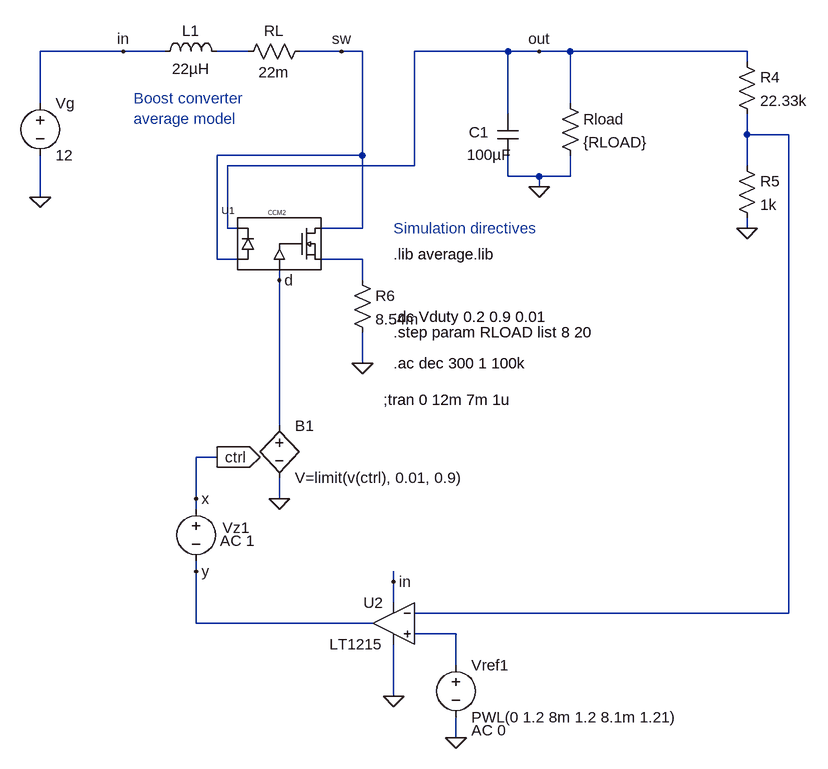
[diagram p0: schematic boost_average_CL_noCompensado.asc]
boost_average_CL_noCompensado.asc, the LTspice schematic file:
Version 4
SHEET 1 1848 724
WIRE 560 -352 432 -352
WIRE 624 -352 560 -352
WIRE 752 -352 704 -352
WIRE 896 -352 832 -352
WIRE 928 -352 896 -352
WIRE 1152 -352 1008 -352
WIRE 1200 -352 1152 -352
WIRE 1248 -352 1200 -352
WIRE 1520 -352 1248 -352
WIRE 1520 -336 1520 -352
WIRE 432 -272 432 -352
WIRE 1248 -272 1248 -352
WIRE 1152 -256 1152 -352
WIRE 1520 -224 1520 -256
WIRE 1584 -224 1520 -224
WIRE 928 -192 928 -352
WIRE 928 -192 704 -192
WIRE 1008 -176 1008 -352
WIRE 1008 -176 720 -176
WIRE 1520 -176 1520 -224
WIRE 1152 -160 1152 -192
WIRE 1200 -160 1152 -160
WIRE 1248 -160 1248 -192
WIRE 1248 -160 1200 -160
WIRE 1200 -144 1200 -160
WIRE 432 -128 432 -192
WIRE 720 -80 720 -176
WIRE 736 -80 720 -80
WIRE 928 -80 928 -192
WIRE 928 -80 864 -80
WIRE 1520 -80 1520 -96
WIRE 704 -32 704 -192
WIRE 736 -32 704 -32
WIRE 928 -32 864 -32
WIRE 800 0 800 -16
WIRE 928 0 928 -32
WIRE 928 128 928 80
WIRE 800 224 800 0
WIRE 704 272 672 272
WIRE 672 336 672 272
WIRE 800 336 800 304
WIRE 672 352 672 336
WIRE 672 448 672 432
WIRE 976 464 976 448
WIRE 976 496 976 464
WIRE 1584 512 1584 -224
WIRE 1584 512 1008 512
WIRE 672 528 672 448
WIRE 944 528 672 528
WIRE 1072 544 1008 544
WIRE 1072 592 1072 544
WIRE 976 640 976 560
WIRE 1072 704 1072 672
FLAG 928 128 0
FLAG 1200 -144 0
FLAG 432 -128 0
FLAG 1200 -352 out
FLAG 896 -352 sw
FLAG 800 0 d
FLAG 560 -352 in
FLAG 976 640 0
FLAG 1072 704 0
FLAG 976 464 in
FLAG 800 336 0
FLAG 704 272 ctrl
IOPIN 704 272 Out
FLAG 672 336 x
FLAG 672 448 y
FLAG 1520 -80 0
SYMBOL cap 1136 -256 R0
WINDOW 0 -44 28 Left 2
WINDOW 3 -47 63 Left 2
SYMATTR InstName C1
SYMATTR Value 100µF
SYMBOL res 1232 -288 R0
SYMATTR InstName Rload
SYMATTR Value {RLOAD}
SYMBOL ind 608 -336 R270
WINDOW 0 32 56 VTop 2
WINDOW 3 5 56 VBottom 2
SYMATTR InstName L1
SYMATTR Value 22µH
SYMBOL res 848 -368 R90
WINDOW 0 0 56 VBottom 2
WINDOW 3 32 56 VTop 2
SYMATTR InstName RL
SYMATTR Value 22m
SYMBOL voltage 432 -288 R0
SYMATTR InstName Vg
SYMATTR Value 12
SYMBOL ccm1 800 -48 M0
SYMATTR InstName U1
SYMATTR Value CCM2
SYMATTR SpiceLine Ron=8m
SYMATTR SpiceLine2 VD=0.5 RD=0.05
SYMBOL Opamps\\LT1215 976 464 M0
SYMATTR InstName U2
SYMBOL voltage 1072 576 R0
WINDOW 123 24 116 Left 2
WINDOW 39 0 0 Left 2
SYMATTR Value2 AC 0
SYMATTR InstName Vref1
SYMATTR Value PWL(0 1.2 8m 1.2 8.1m 1.21)
SYMBOL bv 800 208 R0
SYMATTR InstName B1
SYMATTR Value V=limit(v(ctrl), 0.01, 0.9)
SYMBOL voltage 672 336 R0
WINDOW 0 41 45 Left 2
WINDOW 123 37 65 Left 2
WINDOW 39 0 0 Left 2
SYMATTR InstName Vz1
SYMATTR Value2 AC 1
SYMATTR Value ""
SYMBOL res 1504 -352 R0
SYMATTR InstName R4
SYMATTR Value 22.33k
SYMBOL res 1504 -192 R0
SYMATTR InstName R5
SYMATTR Value 1k
SYMBOL res 912 -16 R0
SYMATTR InstName R6
SYMATTR Value 8.54m
TEXT 976 -80 Left 2 ;Simulation directives
TEXT 976 -40 Left 2 !.lib average.lib
TEXT 576 -280 Left 2 ;Boost converter\naverage model
TEXT 976 128 Left 2 !.ac dec 300 1 100k
TEXT 976 80 Left 2 !.step param RLOAD list 8 20
TEXT 976 56 Left 2 !;dc Vduty 0.2 0.9 0.01
TEXT 960 184 Left 2 !;tran 0 12m 7m 1u

The netlist it stands for:
* boost_average_CL_noCompensado.asc
C1 out 0 100µF
Rload out 0 {RLOAD}
L1 in N001 22µH
RL sw N001 22m
Vg in 0 12
XU1 sw N003 out sw d CCM2 Ron=8m VD=0.5 RD=0.05  ; pins 1 2 3 4 5
XU2 N004 N002 in 0 y LT1215  ; pins In+ In- V+ V- OUT
Vref1 N004 0 PWL(0 1.2 8m 1.2 8.1m 1.21) AC 0
B1 d 0 V=limit(v(ctrl), 0.01, 0.9)
Vz1 x y AC 1
R4 out N002 22.33k
R5 N002 0 1k
R6 N003 0 8.54m
* Simulation directives
.lib average.lib
* Boost converter
* average model
.ac dec 300 1 100k
.step param RLOAD list 8 20
;dc Vduty 0.2 0.9 0.01
;tran 0 12m 7m 1u
.lib LTC.lib
.backanno
.end